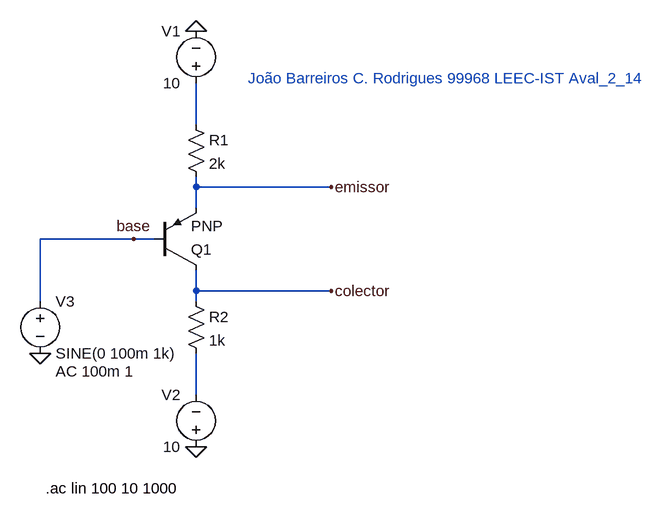
[diagram p0: schematic aval2.asc]
aval2.asc, the LTspice schematic file:
Version 4
SHEET 1 920 680
WIRE 192 0 192 -64
WIRE 192 96 192 80
WIRE 400 96 192 96
WIRE 192 128 192 96
WIRE 96 176 -48 176
WIRE 128 176 96 176
WIRE 192 256 192 224
WIRE 400 256 192 256
WIRE -48 272 -48 176
WIRE 192 272 192 256
WIRE 192 416 192 352
FLAG 192 -144 0
FLAG 192 496 0
FLAG 96 176 base
FLAG 400 256 colector
FLAG 400 96 emissor
FLAG -48 352 0
SYMBOL pnp 128 224 M180
SYMATTR InstName Q1
SYMBOL res 176 -16 R0
SYMATTR InstName R1
SYMATTR Value 2k
SYMBOL res 176 256 R0
SYMATTR InstName R2
SYMATTR Value 1k
SYMBOL voltage 192 -48 R180
WINDOW 0 24 96 Left 2
WINDOW 3 24 16 Left 2
WINDOW 123 0 0 Left 0
WINDOW 39 0 0 Left 0
SYMATTR InstName V1
SYMATTR Value 10
SYMBOL voltage 192 512 R180
WINDOW 0 24 96 Left 2
WINDOW 3 24 16 Left 2
WINDOW 123 0 0 Left 0
WINDOW 39 0 0 Left 0
SYMATTR InstName V2
SYMATTR Value 10
SYMBOL voltage -48 256 R0
WINDOW 123 24 124 Left 2
WINDOW 39 0 0 Left 0
SYMATTR InstName V3
SYMATTR Value SINE(0 100m 1k)
SYMATTR Value2 AC 100m 1
TEXT 272 -72 Left 2 ;João Barreiros C. Rodrigues 99968 LEEC-IST Aval_2_14
TEXT -40 560 Left 2 !.ac lin 100 10 1000

The netlist it stands for:
* aval2.asc
Q1 colector base emissor 0 PNP
R1 N001 emissor 2k
R2 colector N002 1k
V1 N001 0 10
V2 0 N002 10
V3 base 0 SINE(0 100m 1k) AC 100m 1
.model NPN NPN
.model PNP PNP
.lib standard.bjt
* João Barreiros C. Rodrigues 99968 LEEC-IST Aval_2_14
.ac lin 100 10 1000
.backanno
.end